# Altium schematic sheet Processor.SchDoc
size A4; Organization: Altium Limited; Address1: L3, 12a Rodborough Rd; Address2: Frenchs Forest; Address3: NSW; Address4: Australia 2086; DocumentNumber: 2; SheetNumber: 2; SheetTotal: 3
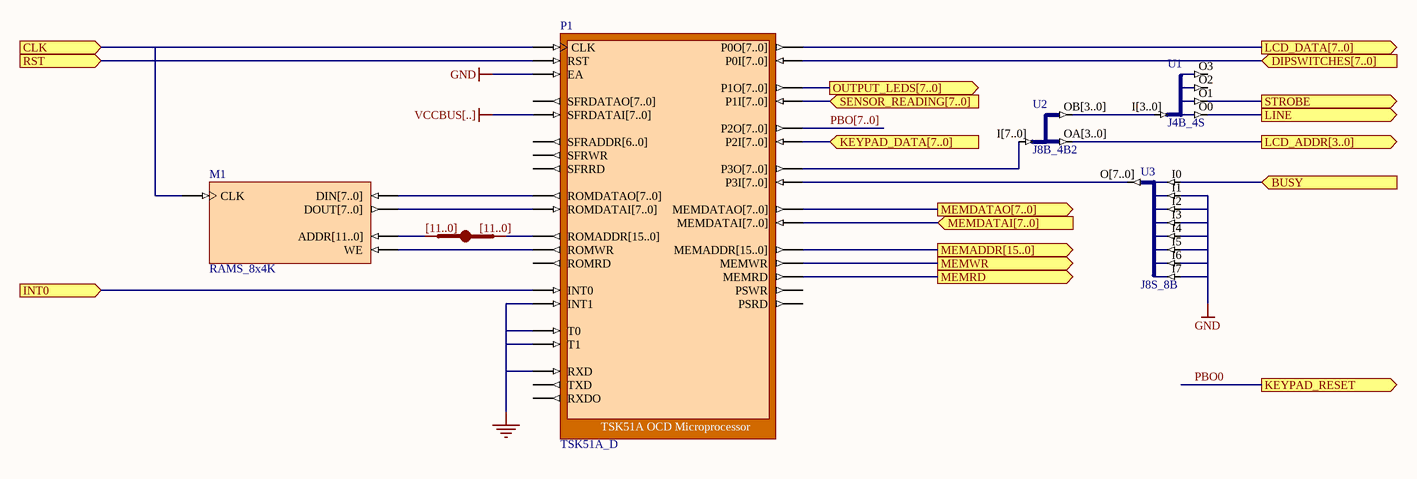
[diagram p0: Processor.SchDoc]

## Parts
M1  RAMS_8x4K
P1  TSK51A_D
U1  J4B_4S
U2  J8B_4B2
U3  J8S_8B
U4  IndexA: [11..0]  (hidden comment: JB)

## Ports
BUSY (in), CLK (in), DIPSWITCHES[7..0] (in), INT0 (in), KEYPAD_DATA[7..0] (in), KEYPAD_RESET (out), LCD_ADDR[3..0] (out), LCD_DATA[7..0] (out), LINE (out), MEMADDR[15..0] (out), MEMDATAI[7..0] (in), MEMDATAO[7..0] (out), MEMRD (out), MEMWR (out), OUTPUT_LEDS[7..0] (out), RST (in), SENSOR_READING[7..0] (in), STROBE (out)

## Nets
GND: P1.EA P1.INT1 P1.RXD P1.T0 P1.T1 U3.I1 U3.I2 U3.I3 U3.I4 U3.I5 U3.I6 U3.I7
VCCBUS[..]: P1.SFRDATAI[7..0]
BUSY: U3.I0 ; port BUSY
CLK: M1.CLK P1.CLK ; port CLK
DIPSWITCHES[7..0]: P1.P0I[7..0] ; port DIPSWITCHES[7..0]
INT0: P1.INT0 ; port INT0
KEYPAD_DATA[7..0]: P1.P2I[7..0] ; port KEYPAD_DATA[7..0]
LCD_ADDR[3..0]: U2.OA[3..0] ; port LCD_ADDR[3..0]
LCD_DATA[7..0]: P1.P0O[7..0] ; port LCD_DATA[7..0]
LINE: U1.O0 ; port LINE
MEMADDR[15..0]: P1.MEMADDR[15..0] ; port MEMADDR[15..0]
MEMDATAI[7..0]: P1.MEMDATAI[7..0] ; port MEMDATAI[7..0]
MEMDATAO[7..0]: P1.MEMDATAO[7..0] ; port MEMDATAO[7..0]
MEMRD: P1.MEMRD ; port MEMRD
MEMWR: P1.MEMWR ; port MEMWR
OUTPUT_LEDS[7..0]: P1.P1O[7..0] ; port OUTPUT_LEDS[7..0]
PBO0: port KEYPAD_RESET
PBO[7..0]: P1.P2O[7..0]
RST: P1.RST ; port RST
SENSOR_READING[7..0]: P1.P1I[7..0] ; port SENSOR_READING[7..0]
STROBE: U1.O1 ; port STROBE
NetM1_ADDR[11..0]: M1.ADDR[11..0] U4.B[0..0]
NetM1_DIN[7..0]: M1.DIN[7..0] P1.ROMDATAO[7..0]
NetM1_DOUT[7..0]: M1.DOUT[7..0] P1.ROMDATAI[7..0]
NetM1_WE: M1.WE P1.ROMWR
NetP1_P3I[7..0]: P1.P3I[7..0] U3.O[7..0]
NetP1_P3O[7..0]: P1.P3O[7..0] U2.I[7..0]
NetP1_ROMADDR[15..0]: P1.ROMADDR[15..0] U4.A[0..0]
NetU1_I[3..0]: U1.I[3..0] U2.OB[3..0]

Not connected (* = marked no-connect by the designer): P1 PSRD PSWR ROMRD RXDO SFRADDR[6..0] SFRDATAO[7..0] SFRRD SFRWR TXD; U1 O2 O3

## Buses and harness runs
bus PBO[7..0]

## Notes on the sheet
- Title
- Size:
- Date:
- A4
- Number:
- Time:
- Revision:
- Sheet
- of
- File:

## Library data of the parts
M1 = RAMS_8x4K: Single Port Random Access Memory; Memory_Depth: 4096; Memory_Type: RAM_SinglePortBlock; Memory_Width: 8; Memory_ClockEdge: Rising; Nexus_Core: Memory_Program; Published: 13/01/2004; Publisher: Altium Hobart Technology Center
P1 = TSK51A_D: TSK51A OCD Microprocessor; NEXUS_CORE: Processor_OCDS; NEXUS_JTAG_DEVICE: True; NEXUS_JTAG_ORDER: 0; ChildModel1: RAM256x8_TSK51D; ChildCore1: M1; Memory_Configuration: Record[NEXUS_CORE]{}ComponentDesignator[iram]{}Memory_Depth[256]{}Memory_UsageType[ram]{}ProgramDownloadAddress[0x0]{}Memory_BusType[c51:idata_bus]{n}Record[NEXUS_CORE]{}ComponentDesignator[xram]{}Memory_Depth[64k]{}Memory_UsageType[ram]{}ProgramDownloadAddress[0x0]{}Memory_BusType[c51:xdata_bus]{n}Record[NEXUS_CORE]{}ComponentDesignator[xrom]{}Memory_Depth[64k]{}Memory_UsageType[rom]{}ProgramDownloadAddress[0x0]{}Memory_BusType[c51:code_bus]{n}; Published: 10/11/2003; Publisher: Altium Hobart Technology Centre; Core Revision: 1.00.00
U1 = J4B_4S: 4-Bit input bus to 4 Single pin outputs; ArchiveName: GENERIC; Published: 18-Dec-2003; Publisher: Altium Limited; Core Revision: 1.00.00
U2 = J8B_4B2: 1 x 8-bit input bus to 2 x 4-Bit output bus; ArchiveName: GENERIC; Published: 18-Dec-2003; Publisher: Altium Limited; Core Revision: 1.00.00
U3 = J8S_8B: 8 Single pin inputs to single 8-Bit output bus; ArchiveName: GENERIC; Published: 18-Dec-2003; Publisher: Altium Limited; Core Revision: 1.00.00
U4 = JB: System BUS Joiner; ArchiveName: GENERIC; Published: 18-Dec-2003; Publisher: Altium Limited; Core Revision: 1.00.00; IndexB: [11..0]